# EasyEDA Pro project ProPrj_Xen_2025-02-04.epro, schematic Scaler

## Sheets
1 Scaler: Board Name: 2. XenScaler; Create Date: 2025-01-25; Page Name: Scaler; Project Name: Xen; Schematic Name: Scaler; Update Date: 2025-02-04; Company: EasyEDA.com; Drawn: EasyEDA; Page Size: A4; Part Number: JLCPCB-002; Reviewed: EasyEDA; Version: V0.1
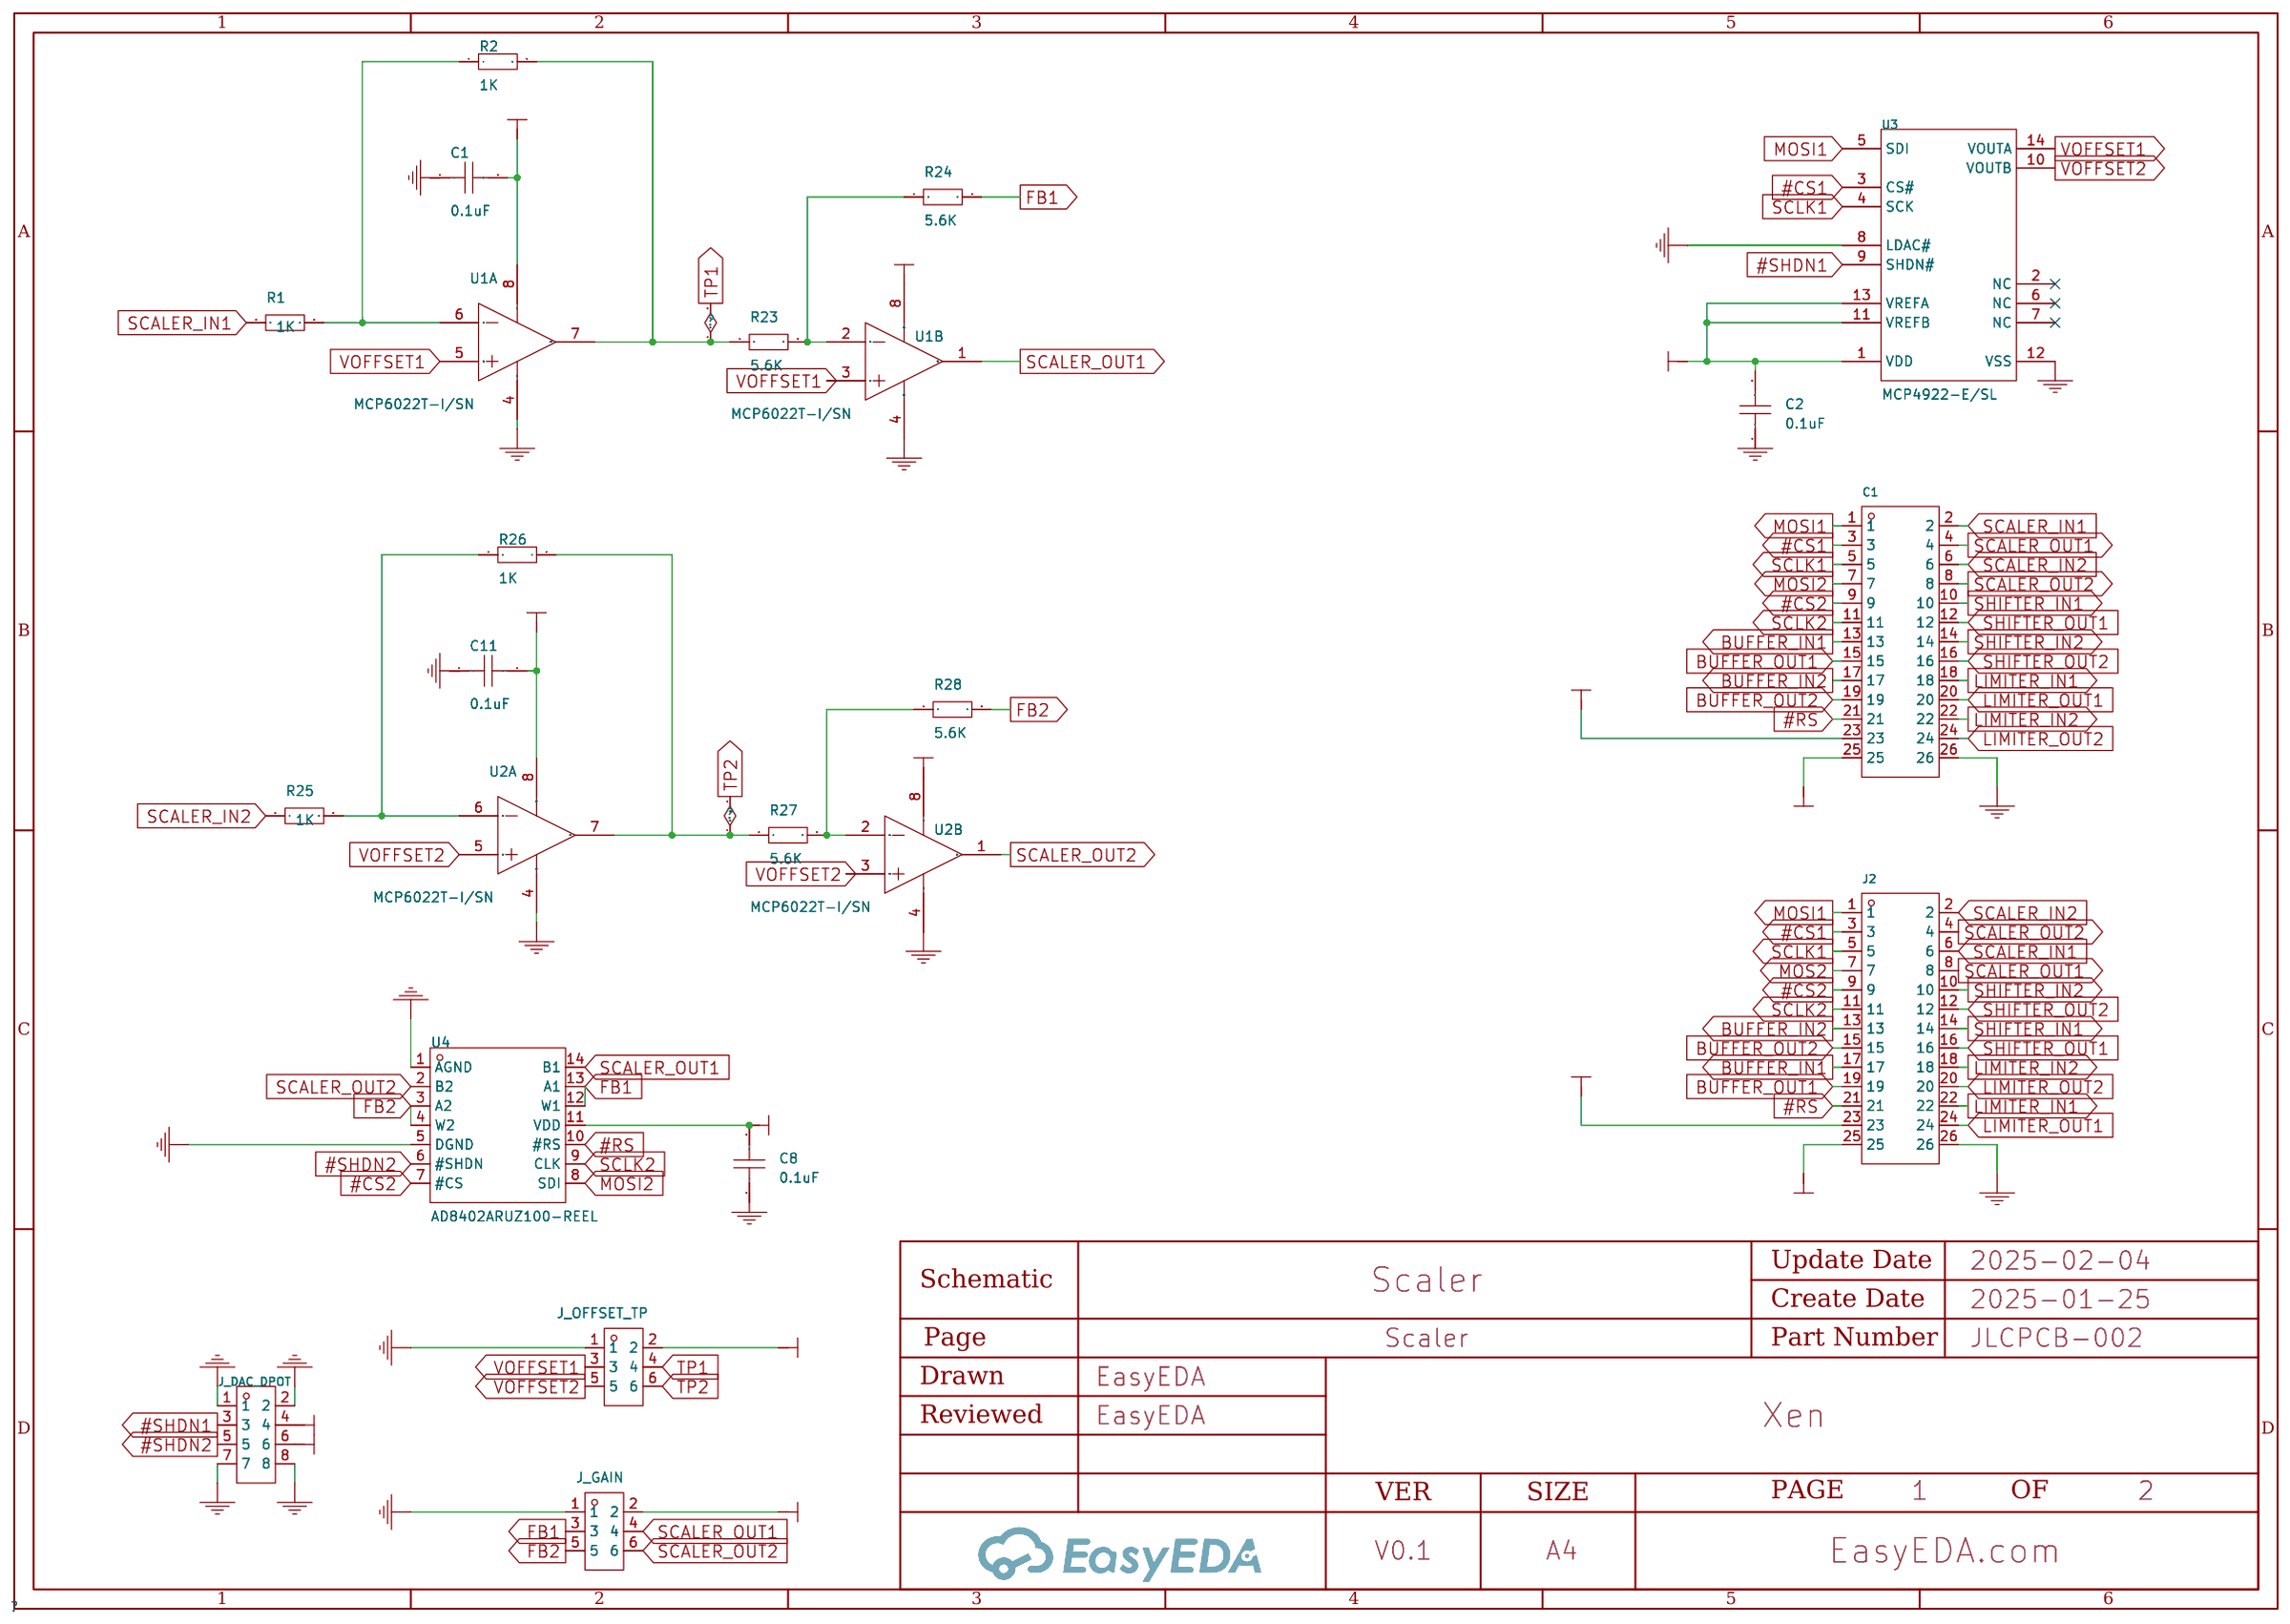
[diagram p21: Scaler]
2 Levelshifter: Board Name: 3. XenScaler; Page Name: Levelshifter
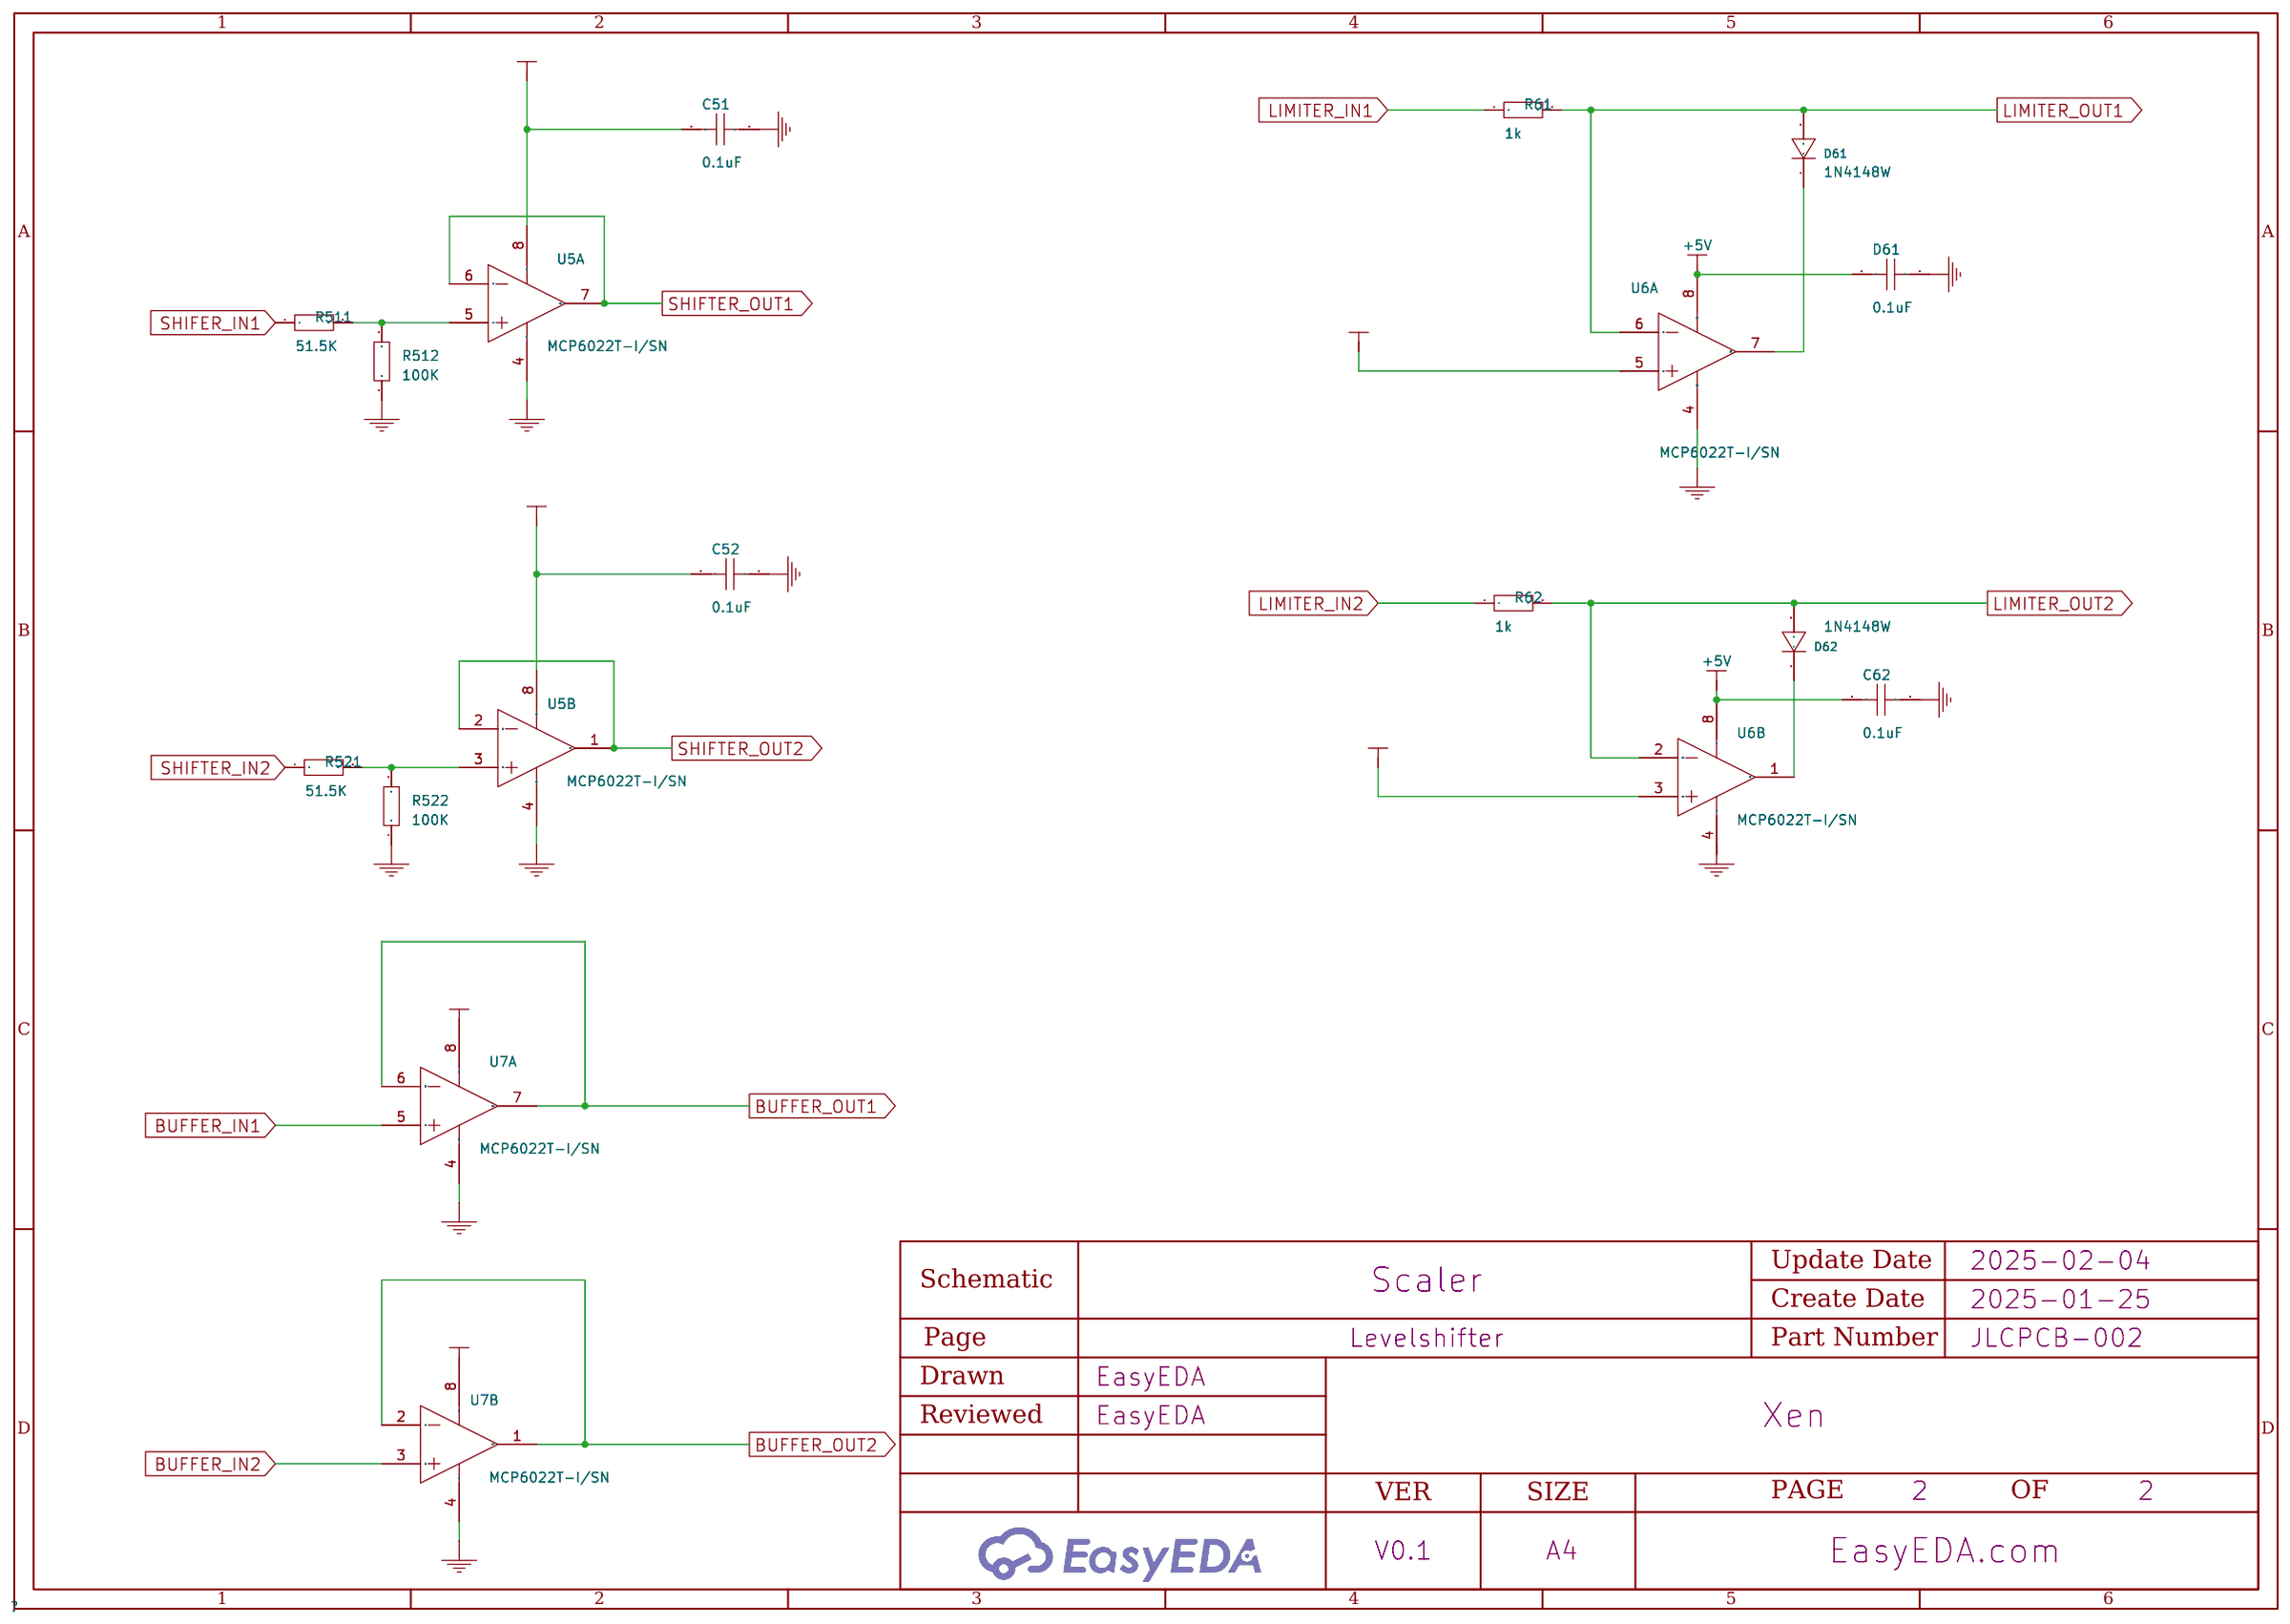
[diagram p22: Levelshifter]

## Parts
sheet Levelshifter
C51  0.1uF  [C0603]
C52  0.1uF  [C0603]
C62  0.1uF  [C0603]
D61  0.1uF  [C0603]
D61#2  1N4148W  [SOD-123F_L2.7-W1.6-LS3.8-RD]
D62  1N4148W  [SOD-123F_L2.7-W1.6-LS3.8-RD]
R61  1k  [R0603]
R62  1k  [R0603]
R511  51.5K  [R0603]
R512  100K  [R0603]
R521  51.5K  [R0603]
R522  100K  [R0603]
U5  MCP6022T-I/SN  [SOIC-8_L4.9-W3.9-P1.27-LS6.0-BL]  (sections 1,2)
U6  MCP6022T-I/SN  [SOIC-8_L4.9-W3.9-P1.27-LS6.0-BL]  (sections 1,2)
U7  MCP6022T-I/SN  [SOIC-8_L4.9-W3.9-P1.27-LS6.0-BL]  (sections 1,2)
sheet Scaler
C1  0.1uF  [C0603]
C1#2  ZX-IDC2.54-2-13PZZ  [IDC-TH_26P-P2.54_ZX-IDC2.54-2-13PZZ]
C2  0.1uF  [C0603]
C8  0.1uF  [C0603]
C11  0.1uF  [C0603]
J2  ZX-IDC2.54-2-13PZZ  [IDC-TH_26P-P2.54_ZX-IDC2.54-2-13PZZ]
J_DAC_DPOT  PZ2.54-2*4  [HDR-TH_8P-P2.54-V-M-R2-C4-S2.54]
J_GAIN  ZX-PZ2.54-2-3PZZ  [HDR-TH_6P-P2.54-V-M-R2-C3-S2.54-1]
J_OFFSET_TP  ZX-PZ2.54-2-3PZZ  [HDR-TH_6P-P2.54-V-M-R2-C3-S2.54-1]
R1  1K  [R0603]
R2  1K  [R0603]
R23  5.6K  [R0603]
R24  5.6K  [R0603]
R25  1K  [R0603]
R26  1K  [R0603]
R27  5.6K  [R0603]
R28  5.6K  [R0603]
U1  MCP6022T-I/SN  [SOIC-8_L4.9-W3.9-P1.27-LS6.0-BL]  (sections 1,2)
U2  MCP6022T-I/SN  [SOIC-8_L4.9-W3.9-P1.27-LS6.0-BL]  (sections 1,2)
U3  MCP4922-E/SL  [SOIC-14_L8.7-W3.9-P1.27-LS6.0-BL]
U4  AD8402ARUZ100-REEL  [TSSOP-14_L5.0-W4.4-P0.65-LS6.4-BL]

## Library data of the parts
C1 C2 C8 C11 C51 C52 C62 D61 = CAP_0603: Supplier Footprint: 0603
D61#2 D62 = 1N4148W_C81598: Diode Configuration: Forward Voltage (Vf@If):1V@50mA Reverse Voltage (Vr): Average Rectified Current (Io): Power Dissipation: Reverse Leakage Current:1uA@75V Reverse Recovery Time (trr): Operating Temperature:- Operating Temperature:-; LCSC Part Name: 电压:75V 电流:150mA; Supplier Part: C81598; Manufacturer: ST(先科); Supplier Footprint: SOD-123; JLCPCB Part Class: Basic Part; Datasheet: https://atta.szlcsc.com/upload/public/pdf/source/20161024/1477288446905.pdf; Supplier: LCSC; Forward Voltage (Vf@If): 1V@50mA; Reverse Leakage Current: 1uA@75V
R1 R2 R23-R28 R61 R62 R511 R512 R521 R522 = Res_0603: Supplier Footprint: 0603
U1 U2 U5-U7 = MCP6022T-I/SN: Number of Circuits:双路 Gain Bandwidth Product(GBP):10MHz Current - Input Bias(Ib):1pA Voltage - Input Offset(Vos):500uV Slew Rate(SR):7V/us Output Current:30mA -3db Bandwidth:- Output Type:- Rail to Rail:- Supply Current:1mA Operating Temperature:-40℃~+85℃; Supplier Part: C57639; Manufacturer: MICROCHIP(美国微芯); Supplier Footprint: SOIC-8; JLCPCB Part Class: Extended Part; Datasheet: https://atta.szlcsc.com/upload/public/pdf/source/20151020/1457707482040.pdf; Supplier: LCSC; Number of Circuits: 双路; Gain Bandwidth Product(GBP): 10MHz; Current - Input Bias(Ib): 1pA; Voltage - Input Offset(Vos): 500uV; Slew Rate(SR): 7V/us; Output Current: 30mA; Supply Current: 1mA; Operating Temperature: -40℃~+85℃
C1#2 J2 = ZX-IDC2.54-2-13PZZ: Connector Type:简牛座 Pitch:2.54mm Structure:2x13P Current Rating (Max):3A Voltage Rating (Max):1kV Holder Type:Straight Row Spacing:2.54mm Number of Rows:2 Pin Number in each Row:13 Contact Material:Brass Contact Plating:Gold Operating Temperature Range:-40; LCSC Part Name: 2.54mm 2x13P 排数:2 每排P数:13; Supplier Part: C7501247; Manufacturer: Megastar(兆星); Supplier Footprint: 插件,P=2.54mm; JLCPCB Part Class: Extended Part; Datasheet: https://atta.szlcsc.com/upload/public/pdf/source/20231122/C34A0102EBF117114DD7A9F9DEFF8982.pdf; Supplier: LCSC; Connector Type: 简牛座; Pitch: 2.54mm; Structure: 2x13P; Current Rating (Max): 3A; Voltage Rating (Max): 1kV; Holder Type: Straight; Row Spacing: 2.54mm; Number of Rows: 2; Pin Number in each Row: 13; Contact Material: Brass; Contact Plating: Gold; Operating Temperature Range: -40℃~+105℃; Soldering Temperature(Max): 260℃@10S
J_DAC_DPOT = PZ2.54-2*4: Pin Structure:2x4P Pitch:2.54mm Number of Rows:双排 Number of Pins:8P; Supplier Part: C5156676; Manufacturer: ZHOURI(洲日); Supplier Footprint: 插件,P=2.54mm; JLCPCB Part Class: Extended Part; Datasheet: https://atta.szlcsc.com/upload/public/pdf/source/20220923/0E7A4A94740FFD503E2D73F36F92C1EA.pdf; Supplier: LCSC; Pin Structure: 2x4P; Pitch: 2.54mm; Number of Rows: 双排; Number of Pins: 8P
J_GAIN J_OFFSET_TP = ZX-PZ2.54-2-3PZZ: Pin Structure:2x3P Pitch:2.54mm Row Spacing:2.54mm Circluar Pins/Square Pins:Square Pins Mounting Type:Straight Number of Rows:双排 Number of Pins:6P Current Rating (Max):3A Voltage Rating (Max):1kV Length of Mating Pin:6mm Insulation Height:2.5mm Length of; LCSC Part Name: 2x3P 间距:2.54mm 方针 直插; Supplier Part: C7501274; Manufacturer: Megastar(兆星); Supplier Footprint: 插件,P=2.54mm; JLCPCB Part Class: Extended Part; Datasheet: https://atta.szlcsc.com/upload/public/pdf/source/20231122/E8390501A702A71E626C593F036B3607.pdf; Supplier: LCSC; Pin Structure: 2x3P; Pitch: 2.54mm; Row Spacing: 2.54mm; Circluar Pins/Square Pins: Square Pins; Mounting Type: Straight; Number of Rows: 双排; Number of Pins: 6P; Current Rating (Max): 3A; Voltage Rating (Max): 1kV; Length of Mating Pin: 6mm; Insulation Height: 2.5mm; Length of End Connection Pin: 3mm; Contact Plating: Gold; Operating Temperature Range: -40℃~+105℃; Color: Black
U3 = MCP4922-E/SL: Interface:SPI Output Type:Voltage-缓冲 Supply Voltage:2.7V~5.5V Supply Voltage:2.7V~5.5V Resolution:12Bit Integral nonlinearity:±4LSB；±0.25LSB Integral nonlinearity:±4LSB；±0.25LSB Settling Time:4.5us Operating Temperature:-40℃~+125℃ Operating Temperature:-4; Supplier Part: C39851; Manufacturer: MICROCHIP(美国微芯); Supplier Footprint: SOIC-14; JLCPCB Part Class: Extended Part; Datasheet: https://atta.szlcsc.com/upload/public/pdf/source/20141219/1457707255746.pdf; Supplier: LCSC; Interface: SPI; Output Type: Voltage-缓冲; Supply Voltage: 2.7V~5.5V; Resolution: 12Bit; Integral nonlinearity: ±4LSB；±0.25LSB; Settling Time: 4.5us; Operating Temperature: -40℃~+125℃
U4 = AD8402ARUZ100-REEL: Resistance Value (Ohms):100kΩ Number of Taps:256 Number of Channels:2 Precision:±30% Precision:±30% Supply Voltage:2.7V~5.5V Supply Voltage:2.7V~5.5V Interface Type:SPI Temperature Coefficient (Typ):500ppm/℃ Temperature Coefficient (Typ):500ppm/℃ Operatin; LCSC Part Name: 256位数字电位计; Supplier Part: C652773; Manufacturer: ADI(亚德诺); Supplier Footprint: TSSOP-14; JLCPCB Part Class: Extended Part; Datasheet: https://atta.szlcsc.com/upload/public/pdf/source/20200109/C467169_22C6BB18B1DB76A0432D458D3EFFE4D7.pdf; Supplier: LCSC; Resistance Value (Ohms): 100kΩ; Number of Taps: 256; Number of Channels: 2; Precision: ±30%; Supply Voltage: 2.7V~5.5V; Interface Type: SPI; Temperature Coefficient (Typ): 500ppm/℃; Operating Temperature: -40℃~+125℃

## Nets
+3.3V: C1#2.23 J2.23 U6.3(VINA+) U6.5(VINB+)
+5V: C1.2 C1#2.25 C2.2 C8.2 C11.2 C51.2 C52.2 C62.2 D61.2 J2.25 J_DAC_DPOT.4 J_DAC_DPOT.6 J_GAIN.2 J_OFFSET_TP.2 U1.8(VDD) U2.8(VDD) U3.1(VDD) U3.11(VREFB) U3.13(VREFA) U4.11(VDD) U5.8(VDD) U6.8(VDD) U7.8(VDD)
GND: C1.1 C1#2.26 C2.1 C8.1 C11.1 C51.1 C52.1 C62.1 D61.1 J2.26 J_DAC_DPOT.1 J_DAC_DPOT.2 J_DAC_DPOT.7 J_DAC_DPOT.8 J_GAIN.1 J_OFFSET_TP.1 R512.1 R522.1 U1.4(VSS) U2.4(VSS) U3.8(LDAC#) U3.12(VSS) U4.1(AGND) U4.5(DGND) U5.4(VSS) U6.4(VSS) U7.4(VSS)
#CS1: C1#2.3 J2.3 U3.3(CS#)
#CS2: C1#2.9 J2.9 U4.7(#CS)
#RS: C1#2.21 J2.21 U4.10(#RS)
#SHDN1: J_DAC_DPOT.3 U3.9(SHDN#)
#SHDN2: J_DAC_DPOT.5 U4.6(#SHDN)
BUFFER_IN1: C1#2.13 J2.17 U7.5(VINB+)
BUFFER_IN2: C1#2.17 J2.13 U7.3(VINA+)
BUFFER_OUT1: C1#2.15 J2.19 U7.6(VINB-) U7.7(VOUTB)
BUFFER_OUT2: C1#2.19 J2.15 U7.1(VOUTA) U7.2(VINA-)
FB1: J_GAIN.3 R24.2 U4.12(W1) U4.13(A1)
FB2: J_GAIN.5 R28.2 U4.3(A2) U4.4(W2)
LIMITER_IN1: C1#2.18 J2.22 R61.1
LIMITER_IN2: C1#2.22 J2.18 R62.1
LIMITER_OUT1: C1#2.20 D61#2.2(A) J2.24 R61.2 U6.6(VINB-)
LIMITER_OUT2: C1#2.24 D62.2(A) J2.20 R62.2 U6.2(VINA-)
MOS2: J2.7
MOSI1: C1#2.1 J2.1 U3.5(SDI)
MOSI2: C1#2.7 U4.8(SDI)
SCALER_IN1: C1#2.2 J2.6 R1.1
SCALER_IN2: C1#2.6 J2.2 R25.1
SCALER_OUT1: C1#2.4 J2.8 J_GAIN.4 U1.1(VOUTA) U4.14(B1)
SCALER_OUT2: C1#2.8 J2.4 J_GAIN.6 U2.1(VOUTA) U4.2(B2)
SCLK1: C1#2.5 J2.5 U3.4(SCK)
SCLK2: C1#2.11 J2.11 U4.9(CLK)
SHIFER_IN1: R511.1
SHIFTER_IN1: C1#2.10 J2.14
SHIFTER_IN2: C1#2.14 J2.10 R521.1
SHIFTER_OUT1: C1#2.12 J2.16 U5.6(VINB-) U5.7(VOUTB)
SHIFTER_OUT2: C1#2.16 J2.12 U5.1(VOUTA) U5.2(VINA-)
TP1: J_OFFSET_TP.4 R2.2 R23.1 U1.7(VOUTB)
TP2: J_OFFSET_TP.6 R26.2 R27.1 U2.7(VOUTB)
VOFFSET1: J_OFFSET_TP.3 U1.3(VINA+) U1.5(VINB+) U3.14(VOUTA)
VOFFSET2: J_OFFSET_TP.5 U2.3(VINA+) U2.5(VINB+) U3.10(VOUTB)
$1N2130: R1.2 R2.1 U1.6(VINB-)
Net-(D61#2-1): D61#2.1(K) U6.7(VOUTB)
Net-(D62-1): D62.1(K) U6.1(VOUTA)
Net-(R23-2): R23.2 R24.1 U1.2(VINA-)
Net-(R25-2): R25.2 R26.1 U2.6(VINB-)
Net-(R27-2): R27.2 R28.1 U2.2(VINA-)
Net-(R511-2): R511.2 R512.2 U5.5(VINB+)
Net-(R521-2): R521.2 R522.2 U5.3(VINA+)

Not connected (* = marked no-connect by the designer): U3 2(NC)* 6(NC)* 7(NC)*
